# Altium project Voltage_regulator.PrjPcb
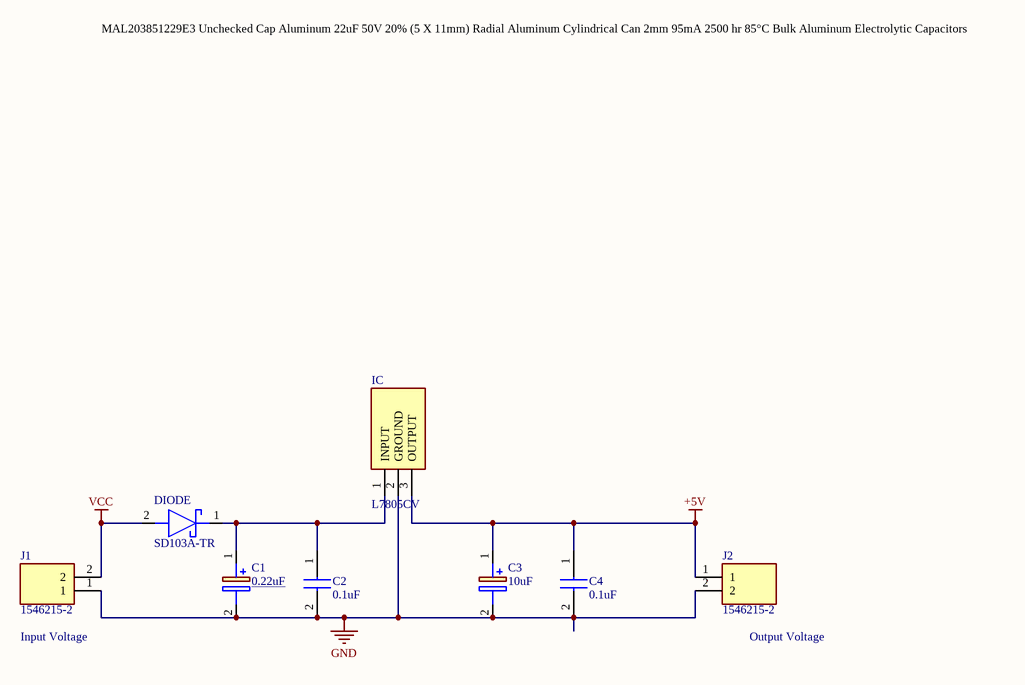
[diagram p0: Voltage_regulator.SchDoc]
1 sheet, 8 parts. Net scope: global (net labels, ports and power ports of the same name join across sheets).
Board file: Voltage_regulator.PcbDoc

## Sheet Voltage_regulator.SchDoc
size A4; SheetNumber: 1; SheetTotal: 1; SPICEModelCacheIFCLVEVK: <root> / <DocumentId>IFCLVEVK</DocumentId> / </root>

### Parts
C1  0.22uF  [CAPAE430X600N]
C2  0.1uF  [S104Z93Z5VL83L0R]
C3  10uF  [CAPPRD200W55D500H1250]
C4  0.1uF  [S104Z93Z5VL83L0R]
DIODE  SD103A-TR  [DIOAD950W60L350D150]
IC  L7805CV  [TO255P460X1020X2008-3P]
J1  1546215-2  [15462152]
J2  1546215-2  [15462152]

### Nets
+5V: C3.1(+) C4.1 IC.3(OUTPUT) J2.1
GND: C1.2(-) C2.2 C3.2(-) C4.2 IC.2(GROUND) J1.1 J2.2
VCC: DIODE.2(A) J1.2
NetC1_1: C1.1(+) C2.1 DIODE.1(K) IC.1(INPUT)

### Notes on the sheet
- MAL203851229E3	Unchecked	Cap Aluminum 22uF 50V 20% (5 X 11mm) Radial Aluminum Cylindrical Can 2mm 95mA 2500 hr 85°C Bulk	Aluminum Electrolytic Capacitors
- (near J1) Input Voltage
- (near J2) Output Voltage

### Library data of the parts
C1 = 224SML050MD4: Capacitor Polarised; Manufacturer_Name: ILLINOIS CAPACITOR; Datasheet Link: https://www.cde.com/resources/catalogs/SML.pdf; Height: 6mm; Manufacturer_Part_Number: 224SML050MD4; Mouser Part Number: 598-224SML050MD4; Mouser Price/Stock: http://www.mouser.com/Search/ProductDetail.aspx?qs=3tP%252bN51vMXdw%2fVfBX1OLjg%3d%3d
C2 C4 = S104Z93Z5VL83L0R: Capacitor; Manufacturer_Name: Vishay; Datasheet Link: http://www.vishay.com/docs/28546/s104z93z.pdf; Height: 23.6mm; Manufacturer_Part_Number: S104Z93Z5VL83L0R; Mouser Part Number: 594-S104Z93Z5VL83L0R; Mouser Price/Stock: https://www.mouser.co.uk/ProductDetail/Vishay-BC-Components/S104Z93Z5VL83L0R?qs=MZE%2F3ll%252Bp%2Fba6C%252BzoK7Jpg%3D%3D; Arrow Part Number: S104Z93Z5VL83L0R; Arrow Price/Stock: https://www.arrow.com/en/products/s104z93z5vl83l0r/vishay
C3 = EEU-FR1H100: Capacitor Polarised; Manufacturer_Name: Panasonic; Datasheet Link: http://industrial.panasonic.com/cdbs/www-data/pdf/RDF0000/ABA0000C1259.pdf; Height: 12.5mm; Manufacturer_Part_Number: EEU-FR1H100; Mouser Part Number: 667-EEU-FR1H100; Mouser Price/Stock: https://www.mouser.co.uk/ProductDetail/Panasonic/EEU-FR1H100?qs=tfZGHB2PWd1NAbdNSgjToQ%3D%3D
DIODE = SD103A-TR: Schottky Diode; Manufacturer_Name: Vishay; Datasheet Link: https://componentsearchengine.com/Datasheets/5/SD103A-TR.pdf; Manufacturer_Part_Number: SD103A-TR; Mouser Part Number: 625-SD103A; Mouser Price/Stock: https://www.mouser.co.uk/ProductDetail/Vishay-Semiconductors/SD103A-TR?qs=RwahMLkpD2urFD%2FzZdGOBw%3D%3D; Arrow Part Number: SD103A-TR; Arrow Price/Stock: https://www.arrow.com/en/products/sd103a-tr/vishay?region=nac
IC = L7805CV: Integrated Circuit; Manufacturer_Name: STMicroelectronics; Datasheet Link: http://www.st.com/web/en/resource/technical/document/datasheet/CD00000444.pdf; Height: 4.6mm; Manufacturer_Part_Number: L7805CV; Mouser Part Number: 511-L7805CV; Mouser Price/Stock: https://www.mouser.co.uk/ProductDetail/STMicroelectronics/L7805CV?qs=9NrABl3fj%2FqplZAHiYUxWg%3D%3D; Arrow Part Number: L7805CV; Arrow Price/Stock: https://www.arrow.com/en/products/l7805cv/stmicroelectronics?region=europe
J1 J2 = 1546215-2: Connector; Manufacturer_Name: TE Connectivity; Datasheet Link: https://www.te.com/commerce/DocumentDelivery/DDEController?Action=srchrtrv&DocNm=1546215&DocType=Customer+Drawing&DocLang=English; Height: 10.3mm; Manufacturer_Part_Number: 1546215-2; Mouser Part Number: 571-1546215-2; Mouser Price/Stock: https://www.mouser.co.uk/ProductDetail/TE-Connectivity/1546215-2?qs=Lxq28tKK6BPmJFoAOY7Ljw%3D%3D; Arrow Part Number: 1546215-2; Arrow Price/Stock: https://www.arrow.com/en/products/1546215-2/te-connectivity?region=nac